# EAGLE design Design (EAGLE 9.6.2)
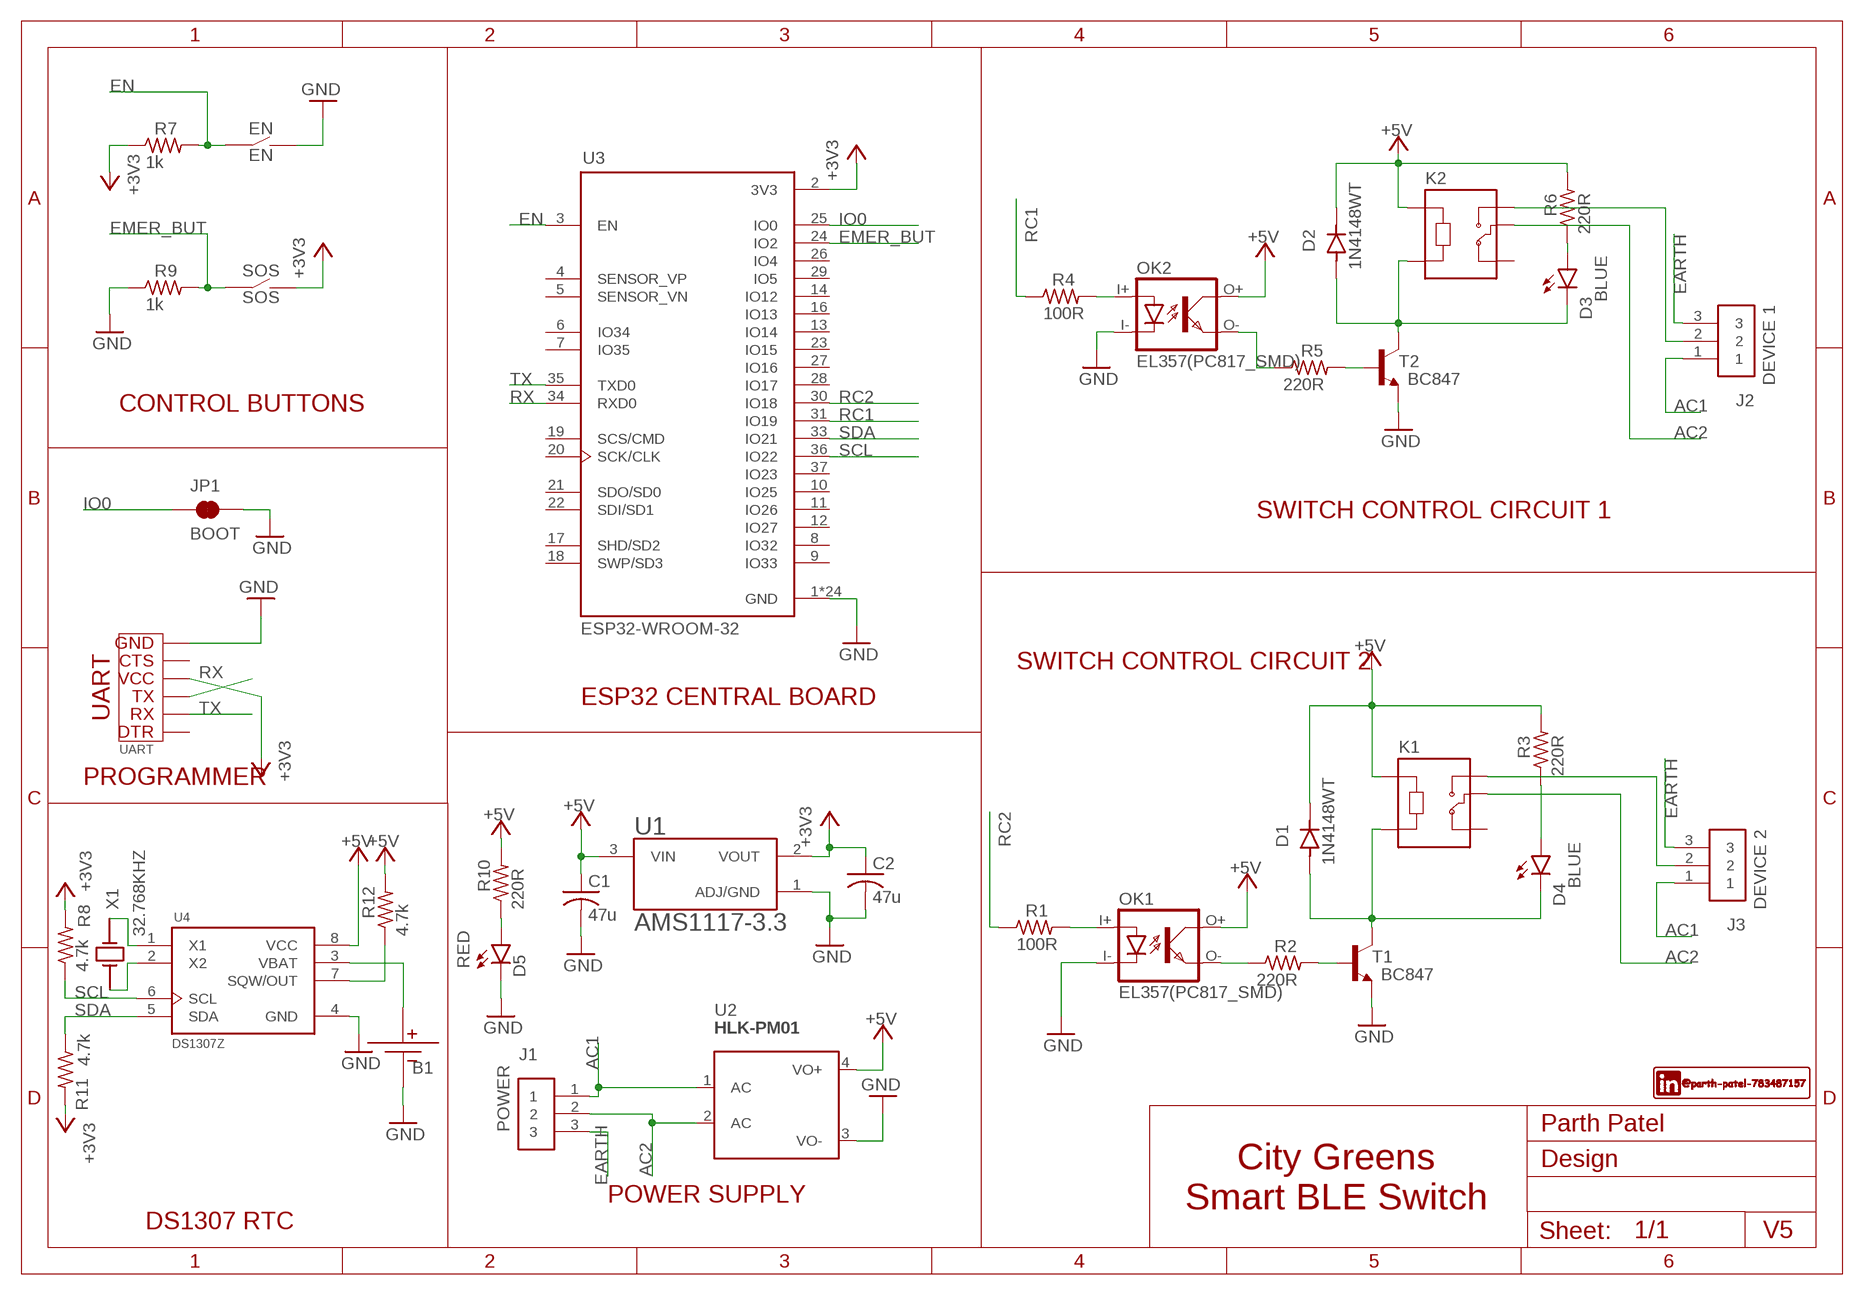
[diagram p0: schematic, sheet 1]

## Parts
B1  CR3032-METAL  [CR2032-METAL]
C1  47u  C-USC0805  [C0805]
C2  47u  C-USC0805  [C0805]
D1  1N4148WT  [SODFL1608X70N]
D2  1N4148WT  [SODFL1608X70N]
D3  BLUE  LEDCHIP-LED0603  [CHIP-LED0603]
D4  BLUE  LEDCHIP-LED0603  [CHIP-LED0603]
D5  RED  LEDCHIP-LED0603  [CHIP-LED0603]
EN  EN  4.5X4.5-SMD-TACTILE-SWITCH  [SMD-4.5X4.5-TACTILE-PUSH-BUTTON]
J1  POWER  691311400103  [TERMINALBLOCK_PLUGGABLE-3-7.62MM]
J2  DEVICE 1  691311400103  [TERMINALBLOCK_PLUGGABLE-3-7.62MM]
J3  DEVICE 2  691311400103  [TERMINALBLOCK_PLUGGABLE-3-7.62MM]
JP1  BOOT  JUMPER-SMT_2_NC_TRACE_SILK  [SMT-JUMPER_2_NC_TRACE_SILK]
K1  SRD-05VDC-SL-C  [RELAY_SRD-05VDC-SL-C]
K2  SRD-05VDC-SL-C  [RELAY_SRD-05VDC-SL-C]
OK1  EL357(PC817_SMD)  [SOP254P715X240-4N]
OK2  EL357(PC817_SMD)  [SOP254P715X240-4N]
R1  100R  R-US_R0805  [R0805]
R2  220R  R-US_R0805  [R0805]
R3  220R  R-US_R0805  [R0805]
R4  100R  R-US_R0805  [R0805]
R5  220R  R-US_R0805  [R0805]
R6  220R  R-US_R0805  [R0805]
R7  1k  R-US_R0805  [R0805]
R8  4.7k  R-US_R0805  [R0805]
R9  1k  R-US_R0805  [R0805]
R10  220R  R-US_R0805  [R0805]
R11  4.7k  R-US_R0805  [R0805]
R12  4.7k  R-US_R0805  [R0805]
SOS  SOS  4.5X4.5-SMD-TACTILE-SWITCH  [SMD-4.5X4.5-TACTILE-PUSH-BUTTON]
T1  BC847  [SOT23]
T2  BC847  [SOT23]
U1  AMS1117-3.3  [SOT229P700X180-4N]
U2  HLK-PM01  [HLK-PM01]
U3  ESP32-WROOM-32  [MODULE_ESP32-WROOM-32]
U4  DS1307Z  [SOIC127P600X175-8N]
UART  UART  [UART]
X1  32.768KHZ  AB38T-32.768KHZ  [XTAL_AB38T-32.768KHZ]

## Nets
+3V3: C2.1 R7.1 R8.2 R11.2 SOS.2.1(S2) SOS.2.2(S2) U1.2(VOUT) U3.2(3V3) UART.VCC
+5V: C1.1 D1.D+ D2.D+ K1.A1 K2.A1 OK1.O+ OK2.O+ R3.2 R6.2 R10.2 R12.2 U1.3(VIN) U2.4(VO+) U4.8(VCC)
AC1: J1.1 J2.1 J3.1 U2.1(AC)
AC2: J1.2 K1.COM K2.COM U2.2(AC)
EARTH: J1.3 J2.3 J3.3
EMER_BUT: R9.2 SOS.1.1(S1) SOS.1.2(S1) U3.24(IO2)
EN: EN.1.1(S1) EN.1.2(S1) R7.2 U3.3(EN)
GND: B1.-VE1(-VE) B1.-VE2(-VE) C1.2 C2.2 D5.C EN.2.1(S2) EN.2.2(S2) JP1.2 OK1.I- OK2.I- R9.1 T1.2(E) T2.2(E) U1.1(ADJ/GND) U2.3(VO-) U3.1(GND) U3.15(GND) U3.38(GND) U3.39_1(GND) U3.39_2(GND) U3.39_3(GND) U3.39_4(GND) U3.39_5(GND) U3.39_6(GND) U3.39_7(GND) U3.39_8(GND) U3.39_9(GND) U3.39_10(GND) U3.39_11(GND) U3.39_12(GND) U3.39_13(GND) U3.39_14(GND) U3.39_15(GND) U3.39_16(GND) U3.39_17(GND) U3.39_18(GND) U3.39_19(GND) U3.39_20(GND) U3.39_21(GND) U4.4(GND) UART.GND
IO0: JP1.1 U3.25(IO0)
N$1: B1.+VE U4.3(VBAT)
N$2: OK1.O- R2.1
N$3: OK1.I+ R1.2
N$4: R2.2 T1.1(B)
N$5: R12.1 U4.7(SQW/OUT)
N$6: D1.D- D4.C K1.A2 T1.3(C)
N$7: D4.A R3.1
N$8: J3.2 K1.NO
N$9: OK2.I+ R4.2
N$10: OK2.O- R5.1
N$11: R5.2 T2.1(B)
N$12: D2.D- D3.C K2.A2 T2.3(C)
N$13: D3.A R6.1
N$14: U4.2(X2) X1.1
N$15: J2.2 K2.NO
N$16: U4.1(X1) X1.2
N$17: D5.A R10.1
RC1: R4.1 U3.31(IO19)
RC2: R1.1 U3.30(IO18)
RX: U3.34(RXD0) UART.TX
SCL: R8.1 U3.36(IO22) U4.6(SCL)
SDA: R11.1 U3.33(IO21) U4.5(SDA)
TX: U3.35(TXD0) UART.RX
Unconnected: K1.NC K2.NC U3.4(SENSOR_VP) U3.5(SENSOR_VN) U3.6(IO34) U3.7(IO35) U3.8(IO32) U3.9(IO33) U3.10(IO25) U3.11(IO26) U3.12(IO27) U3.13(IO14) U3.14(IO12) U3.16(IO13) U3.17(SHD/SD2) U3.18(SWP/SD3) U3.19(SCS/CMD) U3.20(SCK/CLK) U3.21(SDO/SD0) U3.22(SDI/SD1) U3.23(IO15) U3.26(IO4) U3.27(IO16) U3.28(IO17) U3.29(IO5) U3.37(IO23) UART.CTS UART.DTR

## Notes on the sheet
- CONTROL BUTTONS
- SWITCH CONTROL CIRCUIT 1
- SWITCH CONTROL CIRCUIT 2
- ESP32 CENTRAL BOARD
- PROGRAMMER
- Parth Patel
- City Greens
  Smart BLE Switch
- POWER SUPPLY
- DS1307 RTC
- V5

## Library data of the parts
B1 = Battery Holder:CR3032-METAL
C1 C2 = rcl:C-US: CAPACITOR, American symbol; SPICEPREFIX: C
D1 = 1N4148WT:1N4148WT: Diode Switching 100V 0.125A 2-Pin SOD-523 Check availability <https://pricing.snapeda.com/parts/1N4148WT/ON%20Semiconductor/view-part?ref=eda>
D2 = 1N4148WT:1N4148WT: Diode Switching 100V 0.125A 2-Pin SOD-523 Check availability <https://pricing.snapeda.com/parts/1N4148WT/ON%20Semiconductor/view-part?ref=eda>; SPICEPREFIX: D
D3-D5 = led:LED: LED OSRAM: - CHIPLED LG R971, LG N971, LY N971, LG Q971, LY Q971, LO R971, LY R971 LH N974, LH R974 LS Q976, LO Q976, LY Q976 LO Q996 - Hyper CHIPLED LW Q18S LB Q993, LB Q99A, LB R99A - SideLED LS A670, LO A670, LY A670, LG A670, LP A670 LB A673, LV A673, LT A673, LW A673 LH A674 LY A675 LS A676, LA A676, LO A676, LY A676, LW A676 LS A679, LY A679, LG A679 - Hyper Micro SIDELED® LS Y876, LA Y876, LO Y876, LY Y876 LT Y87S - SmartLED LW L88C, LW L88S LB L89C, LB L89S, LG L890 LS L89K, LO L89K, LY L89K LS L896, LA L896, LO L896, LY L896 - TOPLED LS T670, LO T670, LY T670, LG T670, LP T670 LSG T670, LSP T670, LSY T670, LOP T670, LYG T670 LG T671, LOG T671, LSG T671 LB T673, LV T673, LT T673, LW T673 LH T674 LS T676, LA T676, LO T676, LY T676, LB T676, LH T676, LSB T676, LW T676 LB T67C, LV T67C, LT T67C, LS T67K, LO T67K, LY T67K, LW E67C LS E67B, LA E67B, LO E67B, LY E67B, LB E67C, LV E67C, LT E67C LW T67C LS T679, LY T679, LG T679 LS T770, LO T770, LY T770, LG T770, LP T770 LB T773, LV T773, LT T773, LW T773 LH T774 LS E675, LA E675, LY E675, LS T675 LS T776, LA T776, LO T776, LY T776, LB T776 LHGB T686 LT T68C, LB T68C - Hyper Mini TOPLED® LB M676 - Mini TOPLED Santana® LG M470 LS M47K, LO M47K, LY M47K Source: http://www.osram.convergy.de LUXEON: - LUMILED® LXK2-PW12-R00, LXK2-PW12-S00, LXK2-PW14-U00, LXK2-PW14-V00 LXK2-PM12-R00, LXK2-PM12-S00, LXK2-PM14-U00 LXK2-PE12-Q00, LXK2-PE12-R00, LXK2-PE12-S00, LXK2-PE14-T00, LXK2-PE14-U00 LXK2-PB12-K00, LXK2-PB12-L00, LXK2-PB12-M00, LXK2-PB14-N00, LXK2-PB14-P00, LXK2-PB14-Q00 LXK2-PR12-L00, LXK2-PR12-M00, LXK2-PR14-Q00, LXK2-PR14-R00 LXK2-PD12-Q00, LXK2-PD12-R00, LXK2-PD12-S00 LXK2-PH12-R00, LXK2-PH12-S00 LXK2-PL12-P00, LXK2-PL12-Q00, LXK2-PL12-R00 Source: www.luxeon.com KINGBRIGHT: KA-3528ASYC Source: www.kingbright.com
EN SOS = Switches:4.5X4.5-SMD-TACTILE-SWITCH
J1-J3 = Terminal Blocks:691311400103: 7.62MM CLOSE VERTICAL PCB HEADER WR-TBL Manufacturer's datasheet <https://katalog.we-online.com/em/datasheet/6913114001xx.pdf>; CREATED_BY: PCBLayout.com; DIGIKEY_PART_NO: 732-2824-ND; MANUFACTURER: WURTH ELEKTRONIK; MPN: 691311400103
JP1 = SparkFun-Jumpers:JUMPER-SMT_2_NC_TRACE: Normally closed trace jumper This jumper has a trace between two pads so it's normally closed (NC). Use a razor knife to open the connection. For best results follow the IPC guidelines for cutting traces: Cutout at least 0.063 mm (0.005 in). Remove all loose material to clean up the cut area. Seal the cut with an approved epoxy. Reapply solder to reclose the connection.
K1 K2 = SRD-05VDC-SL-C:SRD-05VDC-SL-C: 5V Trigger Relay Module For Arduino And Raspberry Pi 5V Trigger Relay Module For Arduino And Raspberry Pi Check availability <https://pricing.snapeda.com/parts/SRD-05VDC-SL-C/Songle%20Relay/view-part?ref=eda>; AVAILABILITY: In Stock; DESCRIPTION: 5V Trigger Relay Module For Arduino And Raspberry Pi 5V Trigger Relay Module For Arduino And Raspberry Pi; MF: Songle Relay; MP: SRD-05VDC-SL-C; PACKAGE: None; PRICE: None
OK1 OK2 = Optocoupler:EL357(PC817_SMD)
R1-R12 = rcl:R-US_: RESISTOR, American symbol; SPICEPREFIX: R
T1 T2 = transistor:BC847: NPN TRANSISTOR
U1 = AMS1117-3.3:AMS1117-3.3: Sot223/Pkg 1-Amp 3.3-Volt Low Drop Out Voltage Regulatator Check availability <https://pricing.snapeda.com/parts/AMS1117-3.3/AMD/view-part?ref=eda>; AVAILABILITY: Not in stock; DESCRIPTION: LDO Voltage Regulators 800MA LDO LINEAR REG; MF: AMD; MP: AMS1117-3.3; PACKAGE: None; PRICE: None
U2 = Hi-Link AC to DC Power Supply:HLK-PM01: Check prices <https://pricing.snapeda.com/parts/hlk-pm01/Hi-link/view-part?ref=eda>; AVAILABILITY: Not in stock; DESCRIPTION: The 3W ultra-small series module power supply is a small-volume, high-efficiency AC DC power module supply designed by Shenzhen Hi-Link Electronics Co.,Ltd. It has the advantages of global input voltage range, low temperature rise, low power consumption,high efficiency, high reliability and high safety isolation. It has been widely used in smart home, automation control, communications equipment, instrumentation and other industries.; MF: Hi-link; MP: hlk-pm01; PACKAGE: None; PRICE: None
U3 = ESP32-WROOM-32:ESP32-WROOM-32: Bluetooth, WiFi Transceiver Module 2.4GHz ~ 2.5GHz Surface Mount Check availability <https://pricing.snapeda.com/parts/ESP32-WROOM-32/Espressif%20Systems/view-part?ref=eda>; AVAILABILITY: In Stock; DESCRIPTION: Bluetooth, WiFi 802.11b/g/n, Bluetooth v4.2 +EDR, Class 1, 2 and 3 Transceiver Module 2.4GHz ~ 2.5GHz Antenna Not Included, U.FL Surface Mount; MF: Espressif Systems; MP: ESP32-WROOM-32; PACKAGE: Module Espressif Systems; PRICE: None; PURCHASE-URL: https://pricing.snapeda.com/search/part/ESP32-WROOM-32/?ref=eda
U4 = DS1307Z:DS1307Z: Real Time Clock Serial 56Byte 8-Pin SOIC N Check availability <https://pricing.snapeda.com/parts/DS1307Z/Maxim%20Integrated/view-part?ref=eda>; AVAILABILITY: In Stock; DESCRIPTION: Real Time Clock (RTC) IC Clock/Calendar 56B I²C, 2-Wire Serial 8-SOIC (0.154, 3.90mm Width); MF: Maxim Integrated; MP: DS1307Z; PACKAGE: SOIC-8 Maxim; PRICE: None; PURCHASE-URL: https://pricing.snapeda.com/search/part/DS1307Z/?ref=eda
UART = FTDI Adapter:UART
X1 = 32.768KHZ:AB38T-32.768KHZ: AB38T Series 32.768 kHz ±20 ppm 12.5 pF -10 to +60 °C Tuning Fork Crystal Check availability <https://pricing.snapeda.com/parts/AB38T-32.768KHZ/Abracon/view-part?ref=eda>; AVAILABILITY: In Stock; DESCRIPTION: 32.768 kHz ±20ppm Crystal 12.5pF 30 kOhms Cylindrical Can, Radial; MF: Abracon; MP: AB38T-32.768KHZ; PACKAGE: Cylindrical Can Radial Abracon; PRICE: None; PURCHASE-URL: https://pricing.snapeda.com/search/part/AB38T-32.768KHZ/?ref=eda

## Board
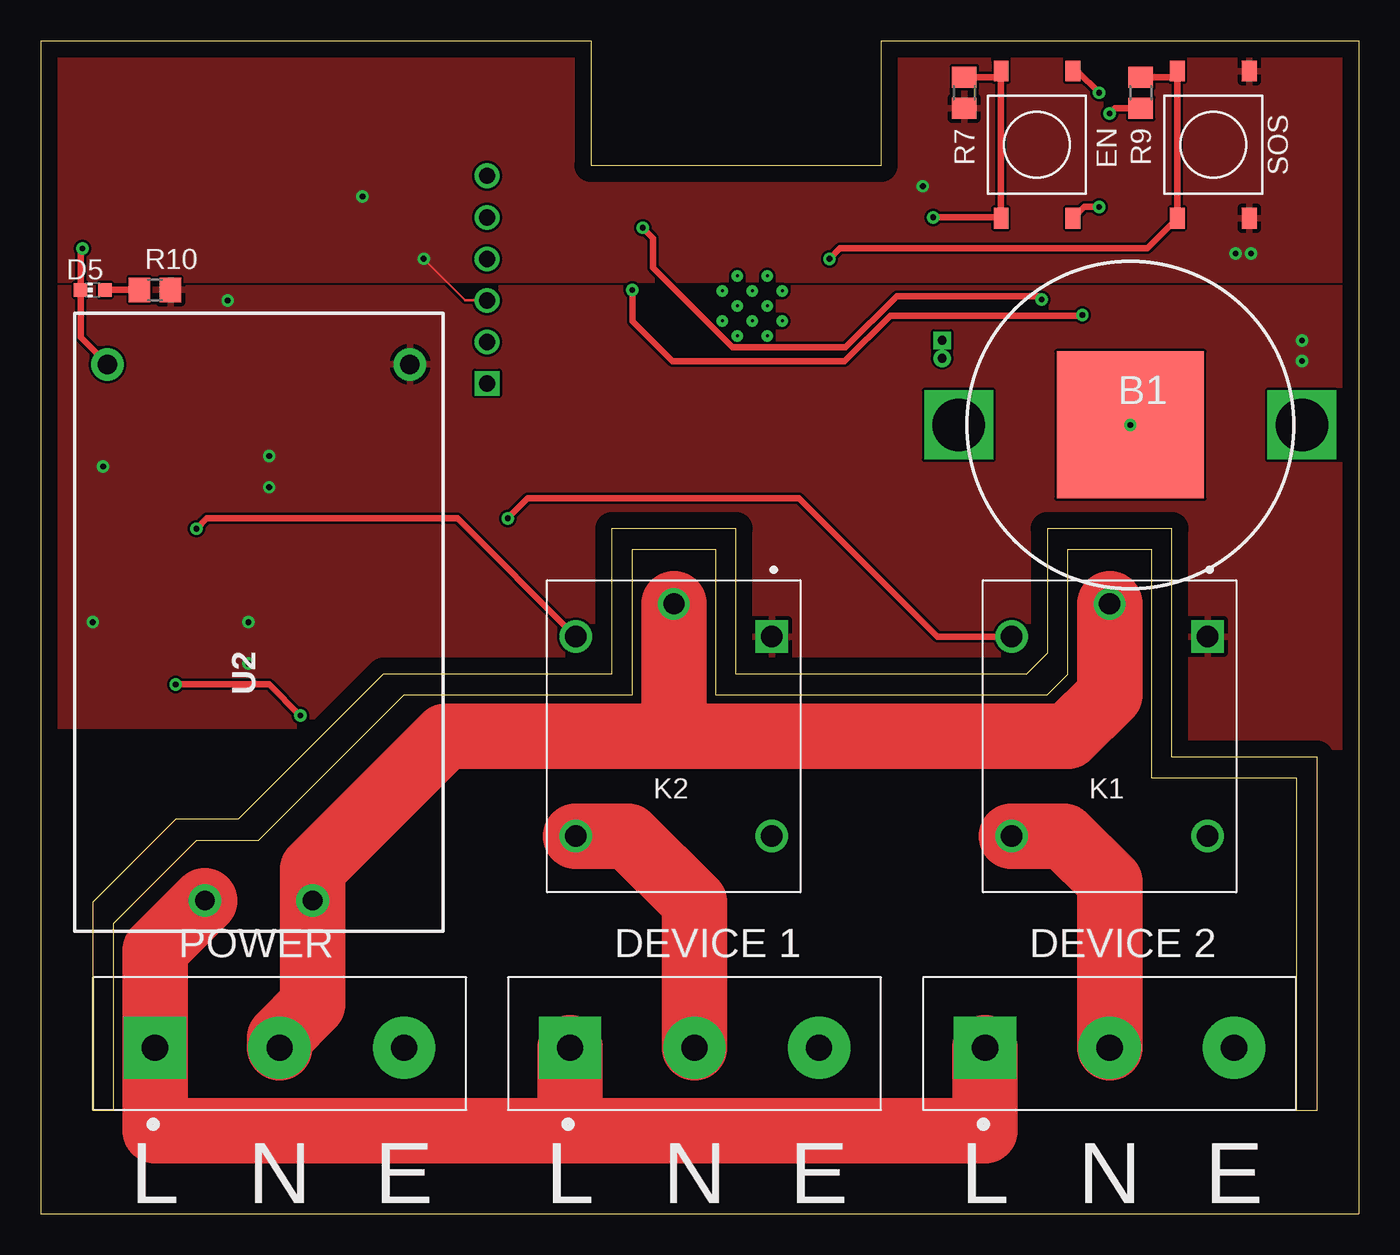
[diagram p1: board, top side]
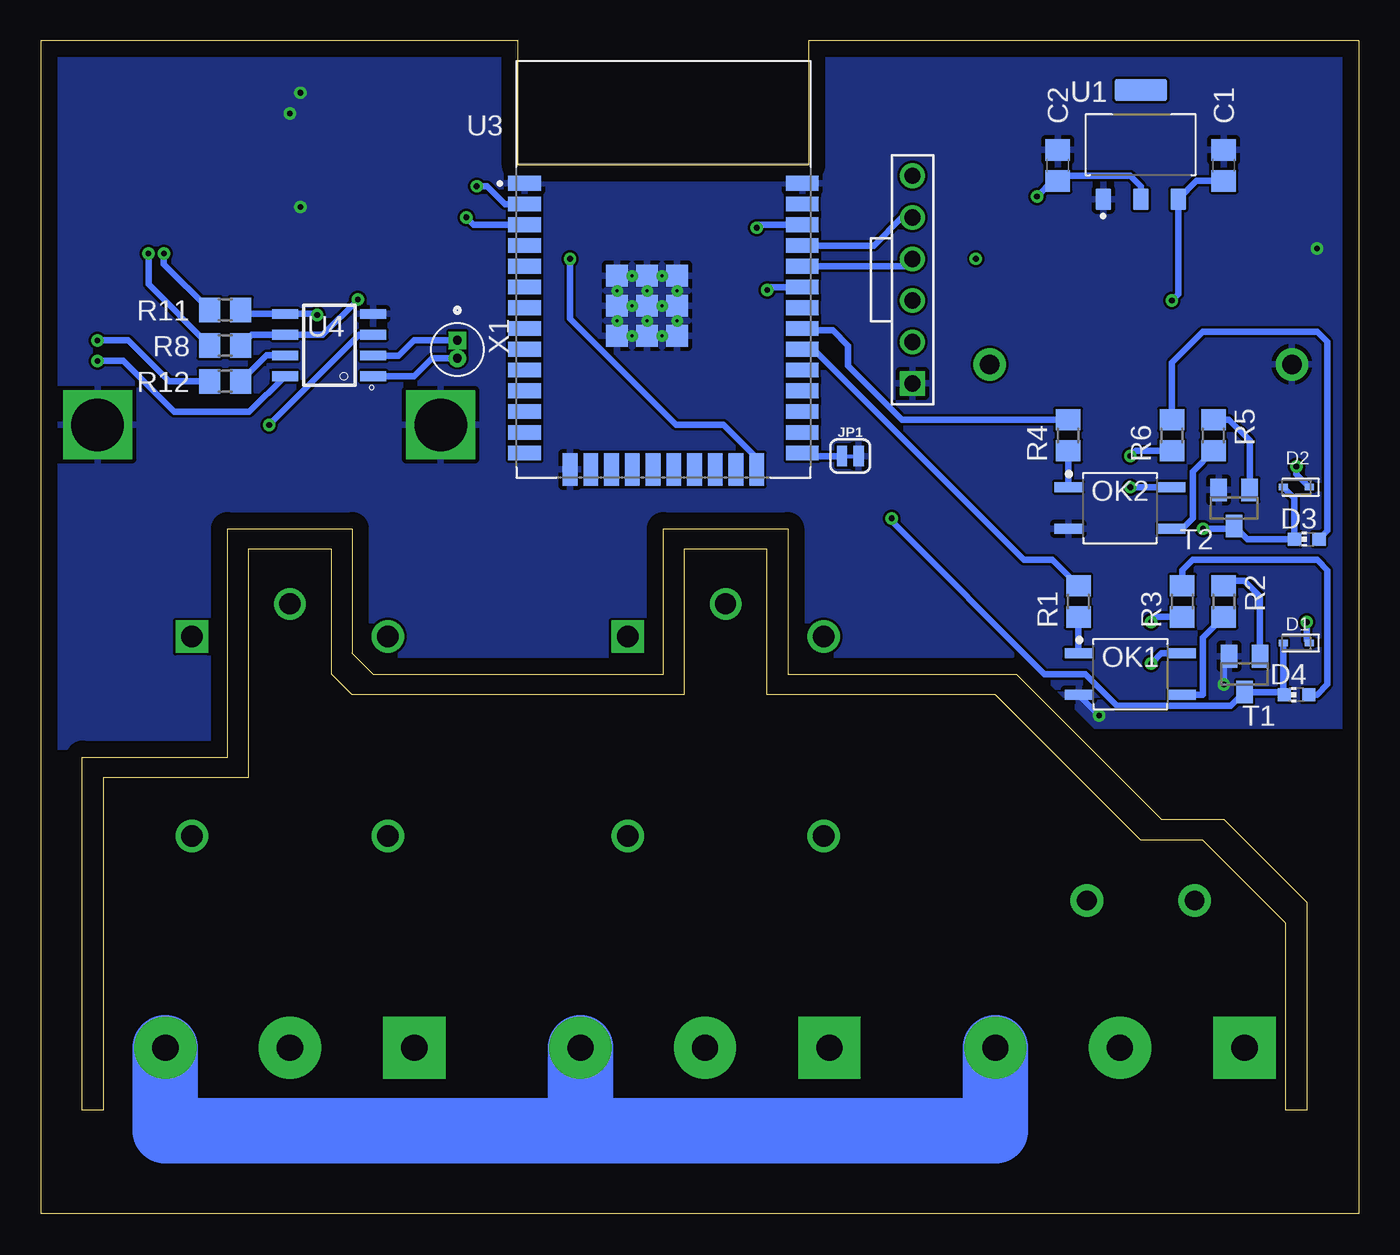
[diagram p2: board, bottom side, seen from below]

Size 80.64 x 71.75 mm. Coordinates in mm from the lower left corner, seen from the top.
Outline: 0,0 80.64,0 80.64,71.75 51.44,71.75 51.44,64.13 33.66,64.13 33.66,71.75 0,71.75 0,0
Outline: 22.22,31.75 36.2,31.75 36.2,40.64 41.27,40.64 41.27,31.75 61.59,31.75 62.87,33.02 62.87,40.64 67.94,40.64 67.94,26.67 76.83,26.67 76.83,6.35 78.1,6.35 78.1,27.94 69.21,27.94 69.21,41.91 61.59,41.91 61.59,34.29 60.33,33.02 42.55,33.02 42.55,41.91 34.93,41.91 34.93,33.02 20.95,33.02 12.06,24.13 8.26,24.13 3.17,19.05 3.17,6.35 4.45,6.35 4.45,17.78 9.53,22.86 13.34,22.86 22.22,31.75
Copper layers (1*16): Top 0.035mm / dielectric 1.5mm / Bottom 0.035mm
Design rules "default *": minimum track width 6mil, minimum drill 0.35mm, track to track 6mil, track to pad 6mil, pad to pad 6mil, via to via 6mil, smd to smd 6mil, copper to edge 40mil, drill to drill 6mil, minimum pad ring 10mil, minimum via ring 8mil, stop-mask expansion 4mil, vias tented up to drill 15mil, thermal gap 10mil

### Footprints (pad centres in the part's own frame; a part is rotated, then mirrored left to right if it is on the bottom)
CR2032-METAL = smd 9 x 9: +VE 0,0 | drill 3.2 square: -VE1 -10.5,0; -VE2 10.5,0
C0805 = smd 1.3 x 1.5: 1 -0.95,0; 2 0.95,0
SODFL1608X70N = smd 0.538 x 0.4: D+ -0.796,0; D- 0.796,0
CHIP-LED0603 = smd 0.8 x 0.8: A 0,-0.75; C 0,0.75
SMD-4.5X4.5-TACTILE-PUSH-BUTTON = smd 1.27 x 0.9: 1.1 -4.5,2.2; 1.2 4.5,2.2; 2.1 -4.5,-2.2; 2.2 4.5,-2.2
TERMINALBLOCK_PLUGGABLE-3-7.62MM = drill 1.6 pad 3.81 square: 1 -7.62,0 | drill 1.6 pad 3.81: 2 0,0; 3 7.62,0
SMT-JUMPER_2_NC_TRACE_SILK = smd 0.635 x 1.27: 1 -0.508,0; 2 0.508,0
RELAY_SRD-05VDC-SL-C = drill 1.32 square: A1 -6.1,6 | drill 1.32: A2 -6.1,-6; NC 6.1,6; NO 6.1,-6 | drill 1.29: COM -8.1,0
SOP254P715X240-4N = smd 1.714 x 0.61: I+ -3.153,1.27; I- -3.153,-1.27; O+ 3.153,1.27; O- 3.153,-1.27
R0805 = smd 1.3 x 1.5: 1 -0.95,0; 2 0.95,0
SOT23 = smd 1 x 1.4: 1 -0.95,-1.1; 2 0.95,-1.1; 3 0,1.1
SOT229P700X180-4N = smd 0.93 x 1.31: 1 -2.29,-3.345; 2 0,-3.345; 3 2.29,-3.345 | smd 3.24 x 1.31: 4 0,3.345
HLK-PM01 = drill 1.2 pad 2: 1 -16.4,3.3; 2 -16.4,-3.3; 3 16.4,9.25; 4 16.4,-9.25
MODULE_ESP32-WROOM-32 = smd 2 x 0.9: 1 -8.5,5.26; 2 -8.5,3.99; 3 -8.5,2.72; 4 -8.5,1.45; 5 -8.5,0.18; 6 -8.5,-1.09; 7 -8.5,-2.36; 8 -8.5,-3.63; 9 -8.5,-4.9; 10 -8.5,-6.17; 11 -8.5,-7.44; 12 -8.5,-8.71; 13 -8.5,-9.98; 14 -8.5,-11.25; 25 8.5,-11.25; 26 8.5,-9.98; 27 8.5,-8.71; 28 8.5,-7.44; 29 8.5,-6.17; 30 8.5,-4.9; 31 8.5,-3.63; 32 8.5,-2.36; 33 8.5,-1.09; 34 8.5,0.18; 35 8.5,1.45; 36 8.5,2.72; 37 8.5,3.99; 38 8.5,5.26 | smd 0.9 x 2: 15 -5.715,-12.25; 16 -4.445,-12.25; 17 -3.175,-12.25; 18 -1.905,-12.25; 19 -0.635,-12.25; 20 0.635,-12.25; 21 1.905,-12.25; 22 3.175,-12.25; 23 4.445,-12.25; 24 5.715,-12.25 | smd 1.33 x 1.33: 39_1 -2.835,-0.405; 39_2 -1,-0.405; 39_3 0.835,-0.405; 39_4 -2.835,-2.24; 39_5 -1,-2.24; 39_6 0.835,-2.24; 39_7 -2.835,-4.075; 39_8 -1,-4.075; 39_9 0.835,-4.075 | drill 0.2 pad 0.3: 39_10 -1.917,-0.405; 39_11 -0.083,-0.405; 39_12 -2.835,-1.323; 39_13 -1,-1.323; 39_14 0.835,-1.323; 39_15 -1.917,-2.24; 39_16 -0.083,-2.24; 39_17 -2.835,-3.158; 39_18 -1,-3.158; 39_19 0.835,-3.158; 39_20 -1.917,-4.075; 39_21 -0.083,-4.075
SOIC127P600X175-8N = smd 1.6 x 0.6: 1 -2.7,1.905; 2 -2.7,0.635; 3 -2.7,-0.635; 4 -2.7,-1.905; 5 2.7,-1.905; 6 2.7,-0.635; 7 2.7,0.635; 8 2.7,1.905
UART = drill 1: CTS 3.81,0; DTR -6.35,0; RX -3.81,0; TX -1.27,0; VCC 1.27,0 | drill 1 square: GND 6.35,0
XTAL_AB38T-32.768KHZ = drill 0.55 pad 0.7 square: 1 -0.55,0 | drill 0.55 pad 0.7: 2 0.55,0

### Placement (x,y rotation side)
B1  66.67,48.26 0 top
C1  8.26,64.13 90 bottom
C2  18.41,64.13 90 bottom
D1  3.81,34.93 180 bottom
D2  3.81,44.45 180 bottom
D3  3.17,41.27 90 bottom
D4  3.81,31.75 90 bottom
D5  3.17,56.52 90 top
EN  60.96,65.41 90 top
J1  14.61,10.16 0 top
J2  40.01,10.16 0 top
J3  65.41,10.16 0 top
JP1  31.11,46.36 0 bottom
K1  65.41,29.21 270 top
K2  38.73,29.21 270 top
OK1  13.97,33.02 0 bottom
OK2  14.61,43.18 0 bottom
R1  17.14,37.47 270 bottom
R2  8.26,37.47 90 bottom
R3  10.79,37.47 270 bottom
R4  17.78,47.62 270 bottom
R5  8.89,47.62 90 bottom
R6  11.43,47.62 270 bottom
R7  56.52,68.58 90 top
R8  69.36,53.12 180 bottom
R9  67.31,68.58 90 top
R10  6.99,56.52 0 top
R11  69.36,55.3 180 bottom
R12  69.36,50.93 180 bottom
SOS  71.75,65.41 90 top
T1  6.99,33.02 180 bottom
T2  7.62,43.18 180 bottom
U1  13.34,65.41 0 bottom
U2  13.34,35.56 90 top
U3  42.55,57.79 0 bottom
U4  63,53.14 180 bottom
UART  27.3,57.15 270 bottom
X1  55.16,52.88 270 bottom

### Tracks (layer width: path | path; a pad name or v marks a point on that pad's centre or on a via)
+3V3  (via drill 0.35)
  Top 0.152: UART.VCC 25.97,55.88 v23.43,58.43
  Bottom 0.406: U1.2 13.34,62.87 13.97,63.5 18.1,63.5 C2.1 18.73,63.19 v19.68,62.23 | U3.2 52.25,61.77 53.34,62.87 v53.98,62.87 | R11.2 73.11,58.1 v73.11,58.74 | R8.2 74.05,56.85 v74.05,58.74
  pour Top: 0,57.15 80.64,57.15 80.64,71.75 0,71.75
+5V  (via drill 0.35)
  Bottom 0.406: C1.1 9.92,63.19 U1.3 11.04,56.27 v11.43,55.88 | 10.82,36.49 R3.2 12.38,36.52 v12.7,36.2 | OK1.O+ 12.06,34.29 v12.7,33.66 | D1.D+ 3.17,35.09 v3.17,36.2 | D2.D+ 3.81,45.25 v3.81,45.72 | OK2.O+ v13.97,44.45 | R6.2 13.65,46.68 v13.97,46.36 | R12.2 72.8,50.93 75.3,53.43 v77.18,53.43 | U4.8 67.89,49.05 72.49,49.05 75.61,52.18 v77.18,52.18
  pour Top (rank 6): 0,57.15 0,29.84 17.14,29.84 20.95,33.66 34.29,33.66 34.29,42.55 43.18,42.55 43.18,33.66 60.33,33.66 60.96,34.29 60.96,41.91 69.85,41.91 69.85,28.57 80.64,28.57 80.64,57.15
AC1
  Top 4: 32.39,5.08 6.99,5.08 J1.1 6.99,16.11 U2.1 | 32.39,5.08 J2.1 | 32.39,5.08 57.79,5.08 J3.1
AC2
  Top 4: 38.73,29.21 24.76,29.21 16.63,21.08 U2.2 16.63,12.81 14.61,10.78 J1.2 | 38.73,29.21 K2.COM | 38.73,29.21 62.87,29.21 65.41,31.75 K1.COM
EARTH
  Bottom 4: J1.3 22.22,5.08 47.62,5.08 | 47.62,5.08 J2.3 | 47.62,5.08 73.02,5.08 J3.3
EMER_BUT  (via drill 0.35)
  Top 0.406: R9.2 69.18,69.53 SOS.1.2 SOS.1.1 67.7,59.05 48.9,59.05 v48.26,58.42
  Bottom 0.406: U3.24 36.83,46.22 38.87,48.26 41.76,48.26 48.26,54.76 v48.26,58.42
EN  (via drill 0.35)
  Top 0.406: R7.2 58.39,69.53 EN.1.2 58.76,61.02 58.71,60.96 | v54.61,60.96 58.71,60.96 | 58.71,60.96 EN.1.1
  Bottom 0.406: U3.3 54.16,60.51 v54.61,60.96
GND  (via drill 0.35)
  Top 0.406: v8.26,32.39 13.97,32.39 v15.88,30.48 | EN.2.2 63.45,69.91 v64.77,68.58 | R9.1 65.72,67.63 v65.41,67.31 | EN.2.1 63.85,61.59 v64.77,61.59 | v2.54,59.05 2.42,58.94 D5.C 2.42,53.62 U2.3
  Bottom 0.406: T1.2 8.26,33.8 v8.26,32.39 | v15.88,30.48 17.12,31.73 OK1.I-
  pour Bottom (rank 6): -0.64,72.39 -0.64,29.84 17.14,29.84 20.95,33.66 34.29,33.66 34.29,42.55 43.18,42.55 43.18,33.66 60.33,33.66 60.96,34.29 60.96,41.91 69.85,41.91 69.85,28.57 81.28,28.57 81.28,72.39
IO0
  Bottom 0.406: JP1.1 33.87,46.36 U3.25
N$1  (via drill 0.35)
  Bottom 0.406: U4.3 61.16,53.78 B1.+VE
  other vias: 66.67,48.26
N$2
  Bottom 0.406: OK1.O- 9.53,31.75 9.53,35.25 R2.1
N$3
  Bottom 0.406: OK1.I+ 17.14,34.31 R1.2
N$4
  Bottom 0.406: T1.1 6.04,37.79 6.99,38.73 7.94,38.73 R2.2
N$5
  Bottom 0.406: U4.7 66.83,52.51 R12.1
N$6  (via drill 0.35)
  Top 0.406: K1.A2 54.86,35.31 46.41,43.76 29.79,43.76 v28.57,42.55
  Bottom 0.406: 4.73,31.92 T1.3 7.82,31.09 14.8,31.09 16.73,33.02 19.23,33.02 28.57,42.36 v28.57,42.55 | 4.73,31.92 D4.C | D1.D- 4.61,32.04 4.73,31.92
N$7
  Bottom 0.406: R3.1 10.79,39.37 10.16,40.01 2.54,40.01 1.91,39.37 1.91,32.39 2.54,31.75 D4.A
N$8
  Top 4: K1.NO 62.62,23.11 65.41,20.32 J3.2
N$9
  Bottom 0.406: OK2.I+ 17.76,46.65 R4.2
N$10
  Bottom 0.406: R5.1 10.16,45.41 10.16,42.55 10.79,41.91 OK2.O-
N$11
  Bottom 0.406: R5.2 7.94,48.58 6.67,47.31 T2.1
N$12  (via drill 0.35)
  Top 0.406: K2.A2 25.5,42.55 10.16,42.55 v9.53,41.91
  Bottom 0.406: D2.D- 3.92,43.77 D3.C 6.82,41.27 T2.3 7.79,41.91 v9.53,41.91
N$13
  Bottom 0.406: D3.A 1.91,41.8 1.91,53.34 2.54,53.98 9.53,53.98 11.43,52.07 R6.1
N$14
  Bottom 0.406: X1.1 57.8,53.43 58.74,52.49 60.29,52.49 U4.2
N$15
  Top 4: J2.2 40.01,19.05 35.95,23.11 K2.NO
N$16
  Bottom 0.406: X1.2 56.71,52.33 57.8,51.24 U4.1
N$17
  Top 0.406: D5.A R10.1
RC1
  Bottom 0.406: R4.1 27.94,48.58 31.24,51.87 31.24,53.12 32.18,54.05 33.94,54.05 U3.31
RC2
  Bottom 0.406: R1.1 18.73,40.01 20.48,40.01 33.36,52.89 U3.30
RX
  Bottom 0.406: U3.34 27.76,57.97 UART.TX
SCL  (via drill 0.35)
  Top 0.406: v36.83,60.33 37.47,59.69 37.47,57.87 42.33,53 49.25,53 52.38,56.13 61.04,56.13 v61.24,55.93
  Bottom 0.406: U3.36 36.65,60.51 v36.83,60.33 | R8.1 67.75,53.78 U4.6 63.39,53.78 v61.24,55.93
SDA  (via drill 0.35)
  Top 0.406: v36.2,56.52 36.2,54.61 38.66,52.15 49.19,52.15 51.98,54.94 63.69,54.94 v63.74,54.99
  Bottom 0.406: v36.2,56.52 36.02,56.7 U3.33 | R11.1 68.16,55.05 U4.5 63.8,55.05 v63.74,54.99
TX
  Bottom 0.406: U3.35 29.66,59.23 27.94,60.96 UART.RX

### Text on the board
tNames: L | N | E | L | N | E | L | N | E
tStop: IN ASSOCIATION WITH / CITY GREENS / AND / EXPERT ENTERPRISE